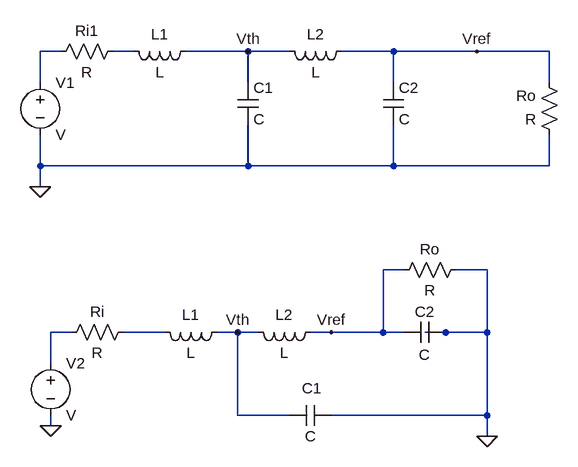
[diagram p0: schematic 2_stage_lc.asc]
2_stage_lc.asc, the LTspice schematic file:
Version 4
SHEET 1 964 680
WIRE 80 -256 48 -256
WIRE 192 -256 160 -256
WIRE 368 -256 272 -256
WIRE 432 -256 368 -256
WIRE 592 -256 512 -256
WIRE 720 -256 592 -256
WIRE 832 -256 720 -256
WIRE 48 -208 48 -256
WIRE 368 -208 368 -256
WIRE 592 -208 592 -256
WIRE 832 -208 832 -256
WIRE 48 -80 48 -128
WIRE 368 -80 368 -144
WIRE 368 -80 48 -80
WIRE 592 -80 592 -144
WIRE 592 -80 368 -80
WIRE 832 -80 832 -128
WIRE 832 -80 592 -80
WIRE 48 -48 48 -80
WIRE 608 80 576 80
WIRE 736 80 688 80
WIRE 96 176 64 176
WIRE 240 176 176 176
WIRE 352 176 320 176
WIRE 384 176 352 176
WIRE 496 176 464 176
WIRE 576 176 576 80
WIRE 576 176 496 176
WIRE 608 176 576 176
WIRE 672 176 640 176
WIRE 736 176 736 80
WIRE 736 176 672 176
WIRE 64 224 64 176
WIRE 352 304 352 176
WIRE 432 304 352 304
WIRE 736 304 736 176
WIRE 736 304 496 304
WIRE 64 320 64 304
WIRE 736 336 736 304
FLAG 48 -48 0
FLAG 496 176 Vref
FLAG 64 320 0
FLAG 736 336 0
FLAG 720 -256 Vref
FLAG 368 -256 Vth
FLAG 352 176 Vth
SYMBOL cap 352 -208 R0
SYMATTR InstName C1
SYMBOL cap 576 -208 R0
SYMATTR InstName C2
SYMBOL res 848 -112 R180
WINDOW 0 36 76 Left 2
WINDOW 3 36 40 Left 2
SYMATTR InstName Ro
SYMBOL ind 528 -272 R90
WINDOW 0 5 56 VBottom 2
WINDOW 3 32 56 VTop 2
SYMATTR InstName L2
SYMBOL ind 288 -272 R90
WINDOW 0 5 56 VBottom 2
WINDOW 3 32 56 VTop 2
SYMATTR InstName L1
SYMBOL voltage 48 -224 R0
SYMATTR InstName V1
SYMBOL cap 496 288 R90
WINDOW 0 -10 30 VBottom 2
WINDOW 3 32 32 VTop 2
SYMATTR InstName C1
SYMBOL cap 672 160 R90
WINDOW 0 0 32 VBottom 2
WINDOW 3 35 32 VTop 2
SYMATTR InstName C2
SYMBOL ind 480 160 R90
WINDOW 0 5 56 VBottom 2
WINDOW 3 32 56 VTop 2
SYMATTR InstName L2
SYMBOL ind 336 160 R90
WINDOW 0 5 56 VBottom 2
WINDOW 3 32 56 VTop 2
SYMATTR InstName L1
SYMBOL voltage 64 208 R0
SYMATTR InstName V2
SYMBOL res 80 192 R270
WINDOW 0 32 56 VTop 2
WINDOW 3 0 56 VBottom 2
SYMATTR InstName Ri
SYMBOL res 704 64 R90
WINDOW 0 0 56 VBottom 2
WINDOW 3 32 56 VTop 2
SYMATTR InstName Ro
SYMBOL res 64 -240 R270
WINDOW 0 32 56 VTop 2
WINDOW 3 0 56 VBottom 2
SYMATTR InstName Ri1

The netlist it stands for:
* 2_stage_lc.asc
C1 Vth 0 C
C2 Vref 0 C
Ro 0 Vref R
L2 Vref Vth L
L1 Vth N002 L
V1 N001 0 V
C1 0 Vth C
C2 0 Vref C
L2 Vref Vth L
L1 Vth N004 L
V2 N003 0 V
Ri N003 N004 R
Ro 0 Vref R
Ri1 N001 N002 R
.backanno
.end